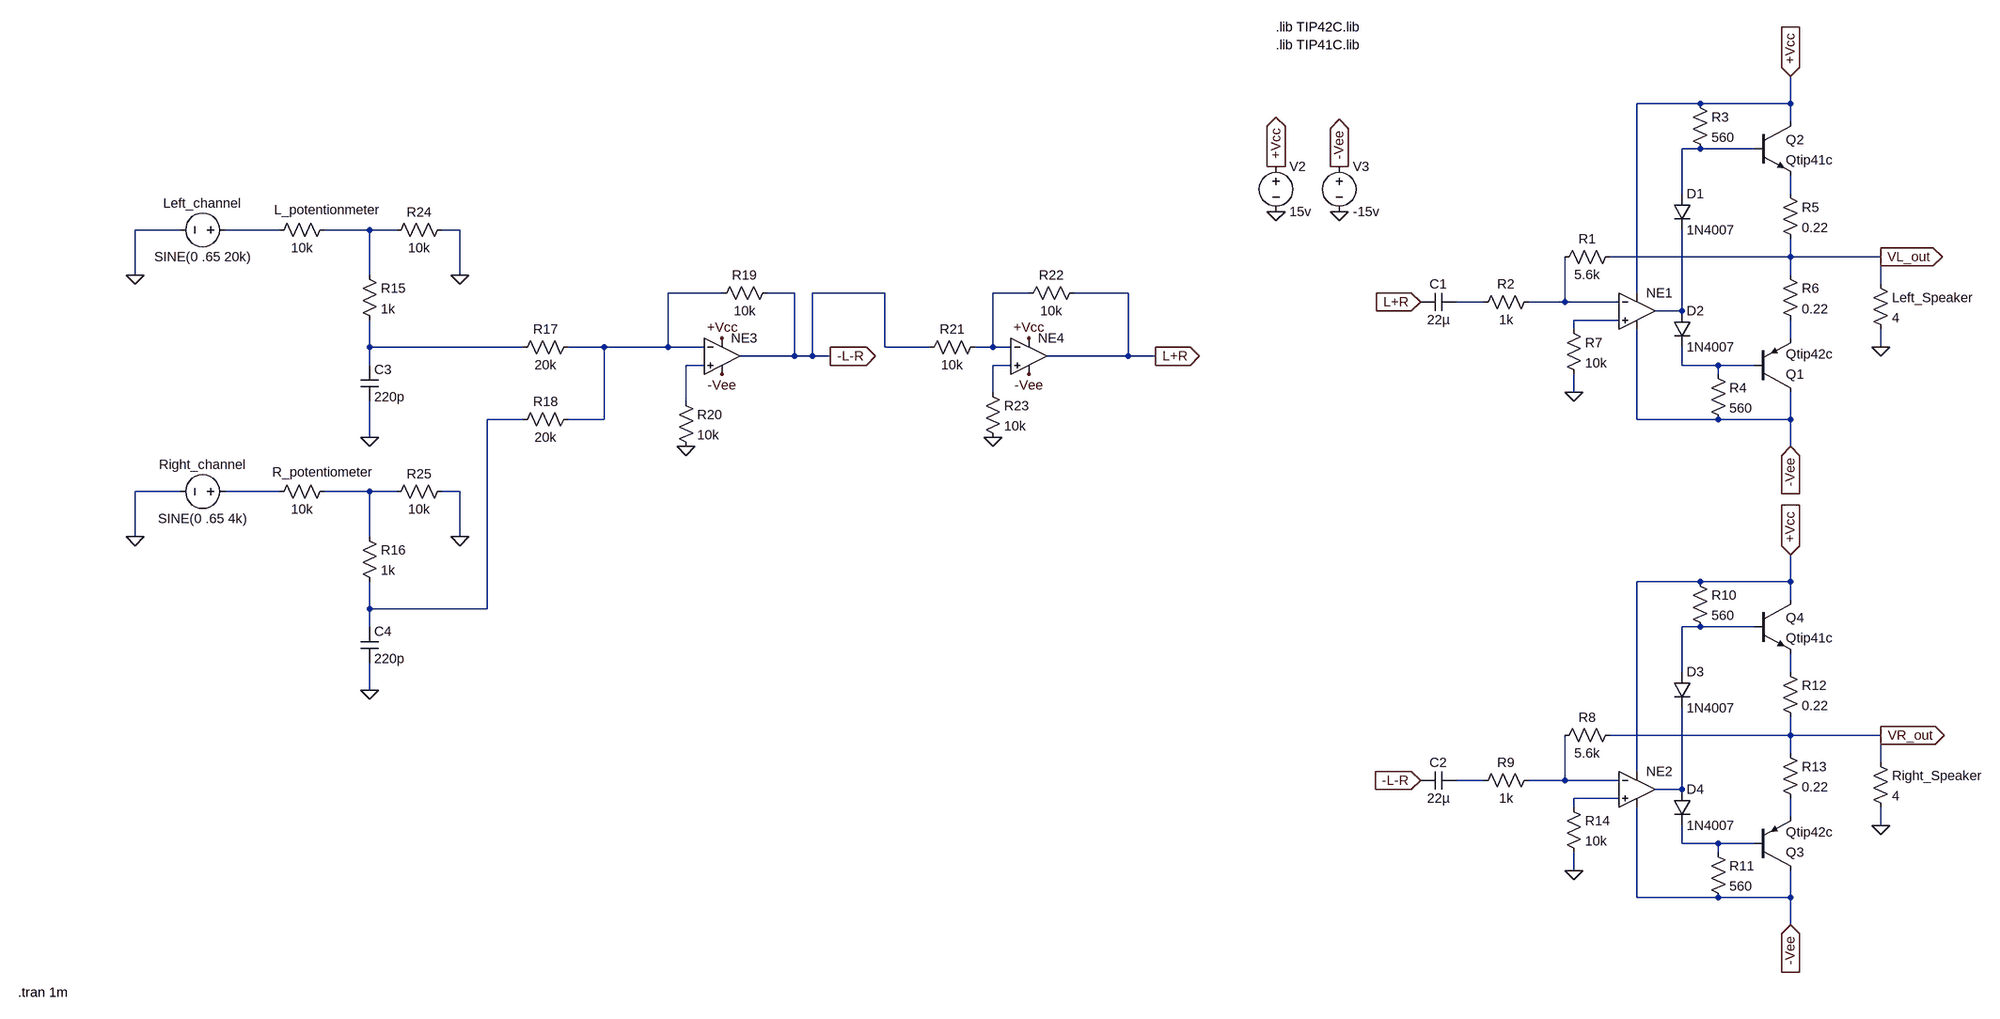
[diagram p0: schematic Bridge Mode.asc]
Bridge Mode.asc, the LTspice schematic file:
Version 4.1
SHEET 1 1348 1680
WIRE 832 -64 720 -64
WIRE 992 -64 992 -112
WIRE 992 -64 832 -64
WIRE 992 -32 992 -64
WIRE 832 16 800 16
WIRE 928 16 832 16
WIRE 800 96 800 16
WIRE 992 96 992 64
WIRE -1888 160 -1968 160
WIRE -1712 160 -1808 160
WIRE -1552 160 -1632 160
WIRE -1504 160 -1552 160
WIRE -1392 160 -1424 160
WIRE 992 208 992 176
WIRE 992 208 672 208
WIRE 1152 208 992 208
WIRE -1968 240 -1968 160
WIRE -1552 240 -1552 160
WIRE -1392 240 -1392 160
WIRE 992 240 992 208
WIRE 1152 256 1152 208
WIRE -912 272 -1008 272
WIRE -784 272 -832 272
WIRE -624 272 -752 272
WIRE -368 272 -432 272
WIRE -192 272 -288 272
WIRE 720 272 720 -64
WIRE 448 288 400 288
WIRE 592 288 592 208
WIRE 592 288 528 288
WIRE 688 288 592 288
WIRE 800 304 800 160
WIRE 800 304 752 304
WIRE 688 320 608 320
WIRE 608 336 608 320
WIRE 992 352 992 320
WIRE -1552 368 -1552 320
WIRE -1280 368 -1552 368
WIRE -1136 368 -1200 368
WIRE -1008 368 -1008 272
WIRE -1008 368 -1136 368
WIRE -944 368 -1008 368
WIRE -624 368 -624 272
WIRE -544 368 -624 368
WIRE -432 368 -432 272
WIRE -432 368 -464 368
WIRE -400 368 -432 368
WIRE 1152 368 1152 336
WIRE -784 384 -784 272
WIRE -784 384 -880 384
WIRE -752 384 -752 272
WIRE -752 384 -784 384
WIRE -720 384 -752 384
WIRE -192 384 -192 272
WIRE -192 384 -336 384
WIRE -144 384 -192 384
WIRE -1552 400 -1552 368
WIRE -944 400 -976 400
WIRE -400 400 -432 400
WIRE 800 400 800 368
WIRE 864 400 800 400
WIRE 928 400 864 400
WIRE 864 416 864 400
WIRE -432 448 -432 400
WIRE 608 448 608 416
WIRE -976 464 -976 400
WIRE -1280 496 -1344 496
WIRE -1136 496 -1136 368
WIRE -1136 496 -1200 496
WIRE 720 496 720 336
WIRE 864 496 720 496
WIRE 992 496 992 448
WIRE 992 496 864 496
WIRE -1552 528 -1552 464
WIRE 992 544 992 496
WIRE -1888 624 -1968 624
WIRE -1712 624 -1808 624
WIRE -1552 624 -1632 624
WIRE -1504 624 -1552 624
WIRE -1392 624 -1424 624
WIRE -1968 704 -1968 624
WIRE -1952 704 -1968 704
WIRE -1552 704 -1552 624
WIRE -1392 704 -1392 624
WIRE 832 784 720 784
WIRE 992 784 992 736
WIRE 992 784 832 784
WIRE 992 816 992 784
WIRE -1552 832 -1552 784
WIRE -1344 832 -1344 496
WIRE -1344 832 -1552 832
WIRE -1552 864 -1552 832
WIRE 832 864 800 864
WIRE 928 864 832 864
WIRE 800 944 800 864
WIRE 992 944 992 912
WIRE -1552 976 -1552 928
WIRE 992 1056 992 1024
WIRE 992 1056 672 1056
WIRE 1152 1056 992 1056
WIRE 992 1088 992 1056
WIRE 1152 1104 1152 1056
WIRE 720 1120 720 784
WIRE 448 1136 400 1136
WIRE 592 1136 592 1056
WIRE 592 1136 528 1136
WIRE 688 1136 592 1136
WIRE 800 1152 800 1008
WIRE 800 1152 752 1152
WIRE 688 1168 608 1168
WIRE 608 1184 608 1168
WIRE 992 1200 992 1168
WIRE 1152 1216 1152 1184
WIRE 800 1248 800 1216
WIRE 864 1248 800 1248
WIRE 928 1248 864 1248
WIRE 864 1264 864 1248
WIRE 608 1296 608 1264
WIRE 720 1344 720 1184
WIRE 864 1344 720 1344
WIRE 992 1344 992 1296
WIRE 992 1344 864 1344
WIRE 992 1392 992 1344
FLAG 1152 208 VL_out
IOPIN 1152 208 Out
FLAG 608 448 0
FLAG 1152 368 0
FLAG 80 128 0
FLAG 192 128 0
FLAG 80 48 +Vcc
IOPIN 80 48 Out
FLAG 192 48 -Vee
IOPIN 192 48 Out
FLAG 992 -112 +Vcc
IOPIN 992 -112 In
FLAG 992 544 -Vee
IOPIN 992 544 In
FLAG 1152 1056 VR_out
IOPIN 1152 1056 Out
FLAG 608 1296 0
FLAG 1152 1216 0
FLAG 992 736 +Vcc
IOPIN 992 736 In
FLAG 992 1392 -Vee
IOPIN 992 1392 In
FLAG -1968 240 0
FLAG -1968 704 0
FLAG -1392 704 0
FLAG -1392 240 0
FLAG -1552 528 0
FLAG -1552 976 0
FLAG -976 544 0
FLAG -720 384 -L-R
IOPIN -720 384 Out
FLAG -432 528 0
FLAG -144 384 L+R
IOPIN -144 384 Out
FLAG 336 288 L+R
IOPIN 336 288 In
FLAG 336 1136 -L-R
IOPIN 336 1136 In
FLAG -912 352 +Vcc
FLAG -368 352 +Vcc
FLAG -912 416 -Vee
FLAG -368 416 -Vee
SYMBOL pnp 928 448 M180
SYMATTR InstName Q1
SYMATTR Value Qtip42c
SYMBOL npn 928 -32 R0
SYMATTR InstName Q2
SYMATTR Value Qtip41c
SYMBOL res 1136 240 R0
SYMATTR InstName Left_Speaker
SYMATTR Value 4
SYMBOL res 688 192 R90
WINDOW 0 0 56 VBottom 2
WINDOW 3 32 56 VTop 2
SYMATTR InstName R1
SYMATTR Value 5.6k
SYMBOL res 544 272 R90
WINDOW 0 0 56 VBottom 2
WINDOW 3 32 56 VTop 2
SYMATTR InstName R2
SYMATTR Value 1k
SYMBOL voltage 80 32 R0
SYMATTR InstName V2
SYMATTR Value 15v
SYMBOL voltage 192 32 R0
SYMATTR InstName V3
SYMATTR Value -15v
SYMBOL diode 784 96 R0
SYMATTR InstName D1
SYMATTR Value 1N4007
SYMBOL diode 784 304 R0
SYMATTR InstName D2
SYMATTR Value 1N4007
SYMBOL res 816 -80 R0
SYMATTR InstName R3
SYMATTR Value 560
SYMBOL res 848 400 R0
SYMATTR InstName R4
SYMATTR Value 560
SYMBOL cap 400 272 R90
WINDOW 0 0 32 VBottom 2
WINDOW 3 32 32 VTop 2
SYMATTR InstName C1
SYMATTR Value 22µ
SYMBOL res 976 80 R0
SYMATTR InstName R5
SYMATTR Value 0.22
SYMBOL res 976 224 R0
SYMATTR InstName R6
SYMATTR Value 0.22
SYMBOL res 592 320 R0
SYMATTR InstName R7
SYMATTR Value 10k
SYMBOL OpAmps\\UniversalOpAmp2 720 304 R0
SYMATTR InstName NE1
SYMATTR Value2 Avol=100k GBW=10Meg Slew=9Meg
SYMATTR SpiceLine Ilimit=38m Rail=0 Vos=0
SYMBOL pnp 928 1296 M180
SYMATTR InstName Q3
SYMATTR Value Qtip42c
SYMBOL npn 928 816 R0
SYMATTR InstName Q4
SYMATTR Value Qtip41c
SYMBOL res 1136 1088 R0
SYMATTR InstName Right_Speaker
SYMATTR Value 4
SYMBOL res 688 1040 R90
WINDOW 0 0 56 VBottom 2
WINDOW 3 32 56 VTop 2
SYMATTR InstName R8
SYMATTR Value 5.6k
SYMBOL res 544 1120 R90
WINDOW 0 0 56 VBottom 2
WINDOW 3 32 56 VTop 2
SYMATTR InstName R9
SYMATTR Value 1k
SYMBOL diode 784 944 R0
SYMATTR InstName D3
SYMATTR Value 1N4007
SYMBOL diode 784 1152 R0
SYMATTR InstName D4
SYMATTR Value 1N4007
SYMBOL res 816 768 R0
SYMATTR InstName R10
SYMATTR Value 560
SYMBOL res 848 1248 R0
SYMATTR InstName R11
SYMATTR Value 560
SYMBOL cap 400 1120 R90
WINDOW 0 0 32 VBottom 2
WINDOW 3 32 32 VTop 2
SYMATTR InstName C2
SYMATTR Value 22µ
SYMBOL res 976 928 R0
SYMATTR InstName R12
SYMATTR Value 0.22
SYMBOL res 976 1072 R0
SYMATTR InstName R13
SYMATTR Value 0.22
SYMBOL res 592 1168 R0
SYMATTR InstName R14
SYMATTR Value 10k
SYMBOL OpAmps\\UniversalOpAmp2 720 1152 R0
SYMATTR InstName NE2
SYMATTR Value2 Avol=100k GBW=10Meg Slew=9Meg
SYMATTR SpiceLine Ilimit=38m Rail=0 Vos=0
SYMBOL voltage -1792 160 R90
WINDOW 0 -32 56 VBottom 2
WINDOW 3 32 56 VTop 2
WINDOW 123 0 0 Left 0
WINDOW 39 0 0 Left 0
SYMATTR InstName Left_channel
SYMATTR Value SINE(0 .65 20k)
SYMBOL voltage -1792 624 R90
WINDOW 0 -32 56 VBottom 2
WINDOW 3 32 56 VTop 2
WINDOW 123 0 0 Left 0
WINDOW 39 0 0 Left 0
SYMATTR InstName Right_channel
SYMATTR Value SINE(0 .65 4k)
SYMBOL res -1616 144 R90
WINDOW 0 -4 11 VBottom 2
WINDOW 3 32 56 VTop 2
SYMATTR InstName L_potentionmeter
SYMATTR Value 10k
SYMBOL res -1616 608 R90
WINDOW 0 -3 19 VBottom 2
WINDOW 3 32 56 VTop 2
SYMATTR InstName R_potentiometer
SYMATTR Value 10k
SYMBOL res -1568 224 R0
SYMATTR InstName R15
SYMATTR Value 1k
SYMBOL res -1568 688 R0
SYMATTR InstName R16
SYMATTR Value 1k
SYMBOL cap -1568 400 R0
SYMATTR InstName C3
SYMATTR Value 220p
SYMBOL cap -1568 864 R0
SYMATTR InstName C4
SYMATTR Value 220p
SYMBOL res -1184 352 R90
WINDOW 0 0 56 VBottom 2
WINDOW 3 32 56 VTop 2
SYMATTR InstName R17
SYMATTR Value 20k
SYMBOL res -1184 480 R90
WINDOW 0 0 56 VBottom 2
WINDOW 3 32 56 VTop 2
SYMATTR InstName R18
SYMATTR Value 20k
SYMBOL res -816 256 R90
WINDOW 0 0 56 VBottom 2
WINDOW 3 32 56 VTop 2
SYMATTR InstName R19
SYMATTR Value 10k
SYMBOL res -992 448 R0
SYMATTR InstName R20
SYMATTR Value 10k
SYMBOL res -448 352 R90
WINDOW 0 0 56 VBottom 2
WINDOW 3 32 56 VTop 2
SYMATTR InstName R21
SYMATTR Value 10k
SYMBOL res -272 256 R90
WINDOW 0 0 56 VBottom 2
WINDOW 3 32 56 VTop 2
SYMATTR InstName R22
SYMATTR Value 10k
SYMBOL res -448 432 R0
SYMATTR InstName R23
SYMATTR Value 10k
SYMBOL OpAmps\\UniversalOpAmp2 -912 384 R0
SYMATTR InstName NE3
SYMATTR Value2 Avol=100k GBW=10Meg Slew=9Meg
SYMATTR SpiceLine Ilimit=38m Rail=0 Vos=0
SYMBOL OpAmps\\UniversalOpAmp2 -368 384 R0
SYMATTR InstName NE4
SYMATTR Value2 Avol=100k GBW=10Meg Slew=9Meg
SYMATTR SpiceLine Ilimit=38m Rail=0 Vos=0
SYMBOL res -1408 144 R90
WINDOW 0 0 56 VBottom 2
WINDOW 3 32 56 VTop 2
SYMATTR InstName R24
SYMATTR Value 10k
SYMBOL res -1408 608 R90
WINDOW 0 0 56 VBottom 2
WINDOW 3 32 56 VTop 2
SYMATTR InstName R25
SYMATTR Value 10k
TEXT 80 -200 Left 2 !.lib TIP42C.lib
TEXT 80 -168 Left 2 !.lib TIP41C.lib
TEXT -2432 1512 Left 2 !.tran 1m

The netlist it stands for:
* Bridge Mode.asc
Q1 -Vee N015 N011 0 Qtip42c
Q2 +Vcc N001 N002 0 Qtip41c
R§Left_Speaker VL_out 0 4
R1 VL_out N008 5.6k
R2 N008 N007 1k
V2 +Vcc 0 15v
V3 -Vee 0 -15v
D1 N001 N009 1N4007
D2 N009 N015 1N4007
R3 +Vcc N001 560
R4 N015 -Vee 560
C1 N007 L+R 22µ
R5 N002 VL_out 0.22
R6 VL_out N011 0.22
R7 N010 0 10k
X§NE1 N010 N008 +Vcc -Vee N009 level2 Avol=100k GBW=10Meg Slew=9Meg Ilimit=38m Rail=0 Vos=0 En=0 Enk=0 In=0 Ink=0 Rin=500Meg  ; pins In+ In- V+ V- OUT
Q3 -Vee N026 N025 0 Qtip42c
Q4 +Vcc N019 N020 0 Qtip41c
Right_Speaker VR_out 0 4
R8 VR_out N022 5.6k
R9 N022 N021 1k
D3 N019 N023 1N4007
D4 N023 N026 1N4007
R10 +Vcc N019 560
R11 N026 -Vee 560
C2 N021 -L-R 22µ
R12 N020 VR_out 0.22
R13 VR_out N025 0.22
R14 N024 0 10k
X§NE2 N024 N022 +Vcc -Vee N023 level2 Avol=100k GBW=10Meg Slew=9Meg Ilimit=38m Rail=0 Vos=0 En=0 Enk=0 In=0 Ink=0 Rin=500Meg  ; pins In+ In- V+ V- OUT
V§Left_channel N003 0 SINE(0 .65 20k)
V§Right_channel N017 0 SINE(0 .65 4k)
R§L_potentionmeter N004 N003 10k
R_potentiometer N018 N017 10k
R15 N004 N012 1k
R16 N018 N016 1k
C3 N012 0 220p
C4 N016 0 220p
R17 N005 N012 20k
R18 N005 N016 20k
R19 -L-R N005 10k
R20 N013 0 10k
R21 N006 -L-R 10k
R22 L+R N006 10k
R23 N014 0 10k
X§NE3 N013 N005 +Vcc -Vee -L-R level2 Avol=100k GBW=10Meg Slew=9Meg Ilimit=38m Rail=0 Vos=0 En=0 Enk=0 In=0 Ink=0 Rin=500Meg  ; pins In+ In- V+ V- OUT
X§NE4 N014 N006 +Vcc -Vee L+R level2 Avol=100k GBW=10Meg Slew=9Meg Ilimit=38m Rail=0 Vos=0 En=0 Enk=0 In=0 Ink=0 Rin=500Meg  ; pins In+ In- V+ V- OUT
R24 0 N004 10k
R25 0 N018 10k
.model D D
.lib standard.dio
.model NPN NPN
.model PNP PNP
.lib standard.bjt
.lib TIP42C.lib
.lib TIP41C.lib
.tran 1m
.lib UniversalOpAmp2.lib
.backanno
.end